# EasyEDA Pro project ESP32核心板带屏幕陀螺仪can接口.epro

# Schematic Schematic1
Create Date: 2023-09-02; Page Name: P1; Project Name: 自制ESP32PICO; Schematic Name: Schematic1; Update Date: 2023-09-13; Company: 嘉立创EDA; Page Size: A4; Version: V1.0
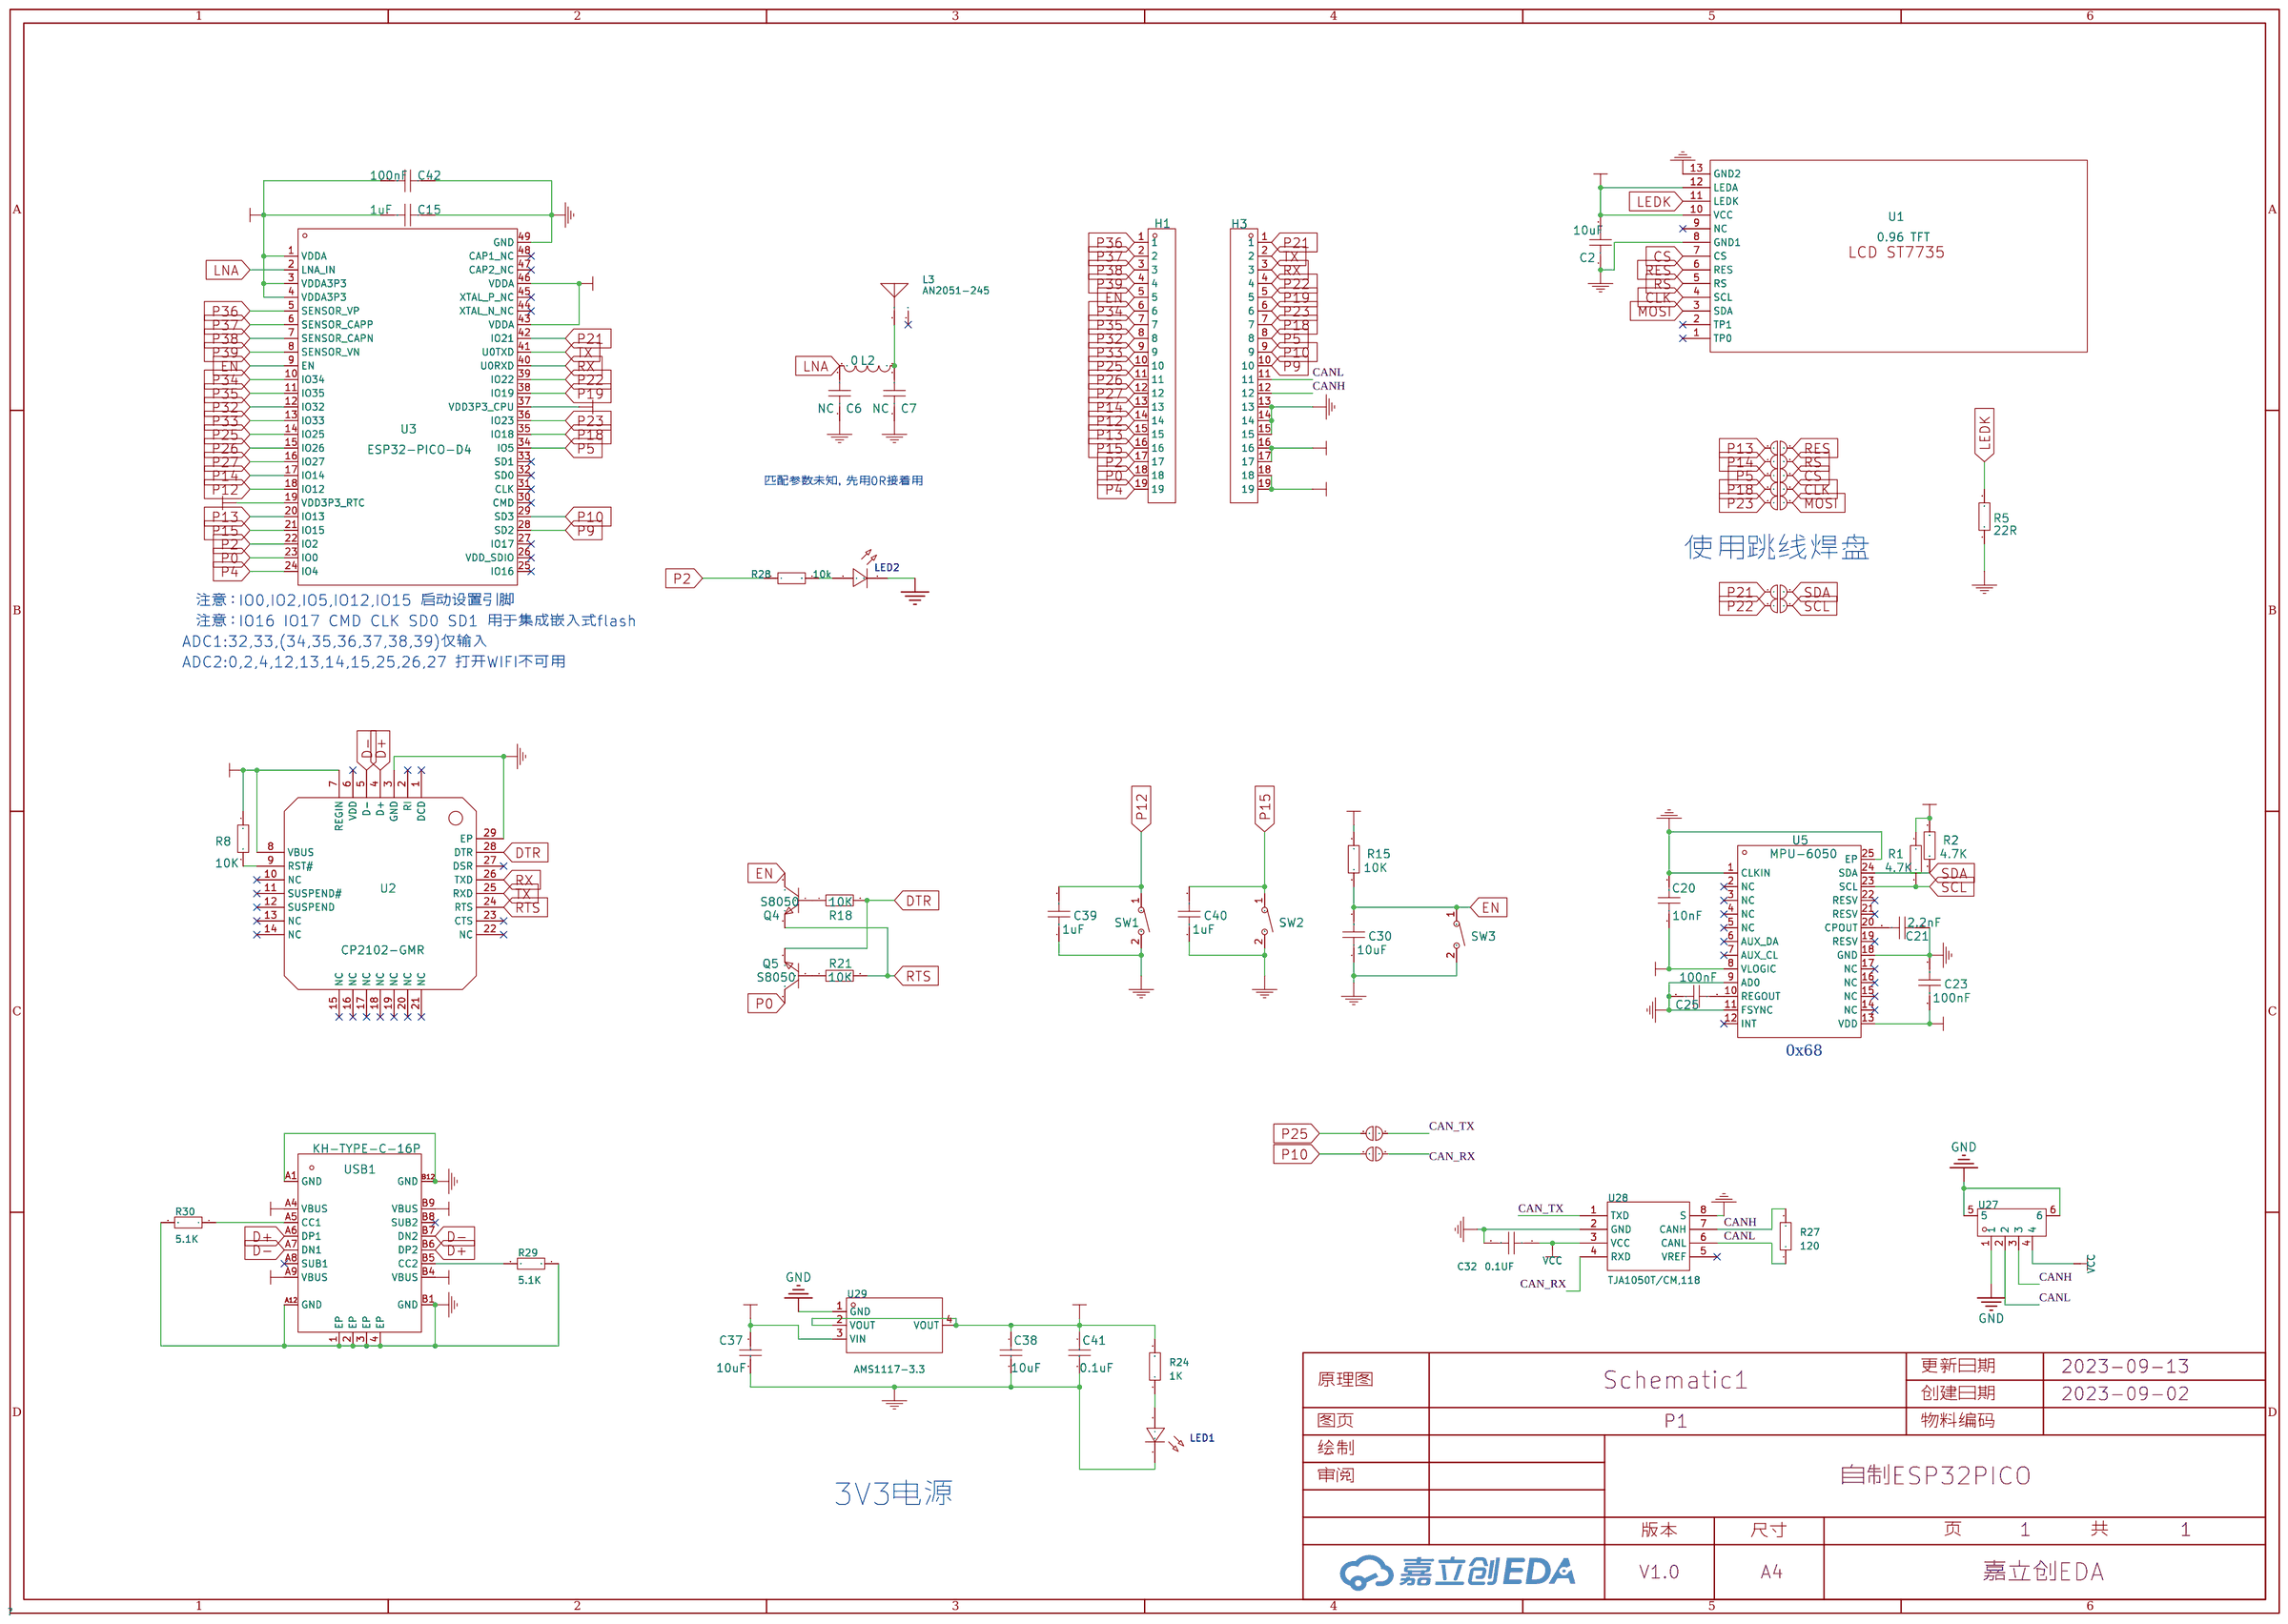
[diagram p0: schematic sheet]

## Parts
C2  10uF  [C0603]
C6  NC  [C0402]
C7  NC  [C0402]
C15  1uF  [C0603]
C20  10nF  [C0603]
C21  2.2nF  [C0603]
C23  100nF  [C0603]
C25  100nF  [C0603]
C30  10uF  [C0603]
C32  0.1UF  [c0603]
C37  10uF  [C0603]
C38  10uF  [C0603]
C39  1uF  [C0603]
C40  1uF  [C0603]
C41  0.1uF  [C0603]
C42  100nF  [C0603]
H1  X6511WV-19H-C30D60  [HDR-TH_19P-P2.54-V-M]
H3  X6511WV-19H-C30D60  [HDR-TH_19P-P2.54-V-M]
J2  跳线焊盘  [0402L焊盘]
J3  跳线焊盘  [0402L焊盘]
J4  跳线焊盘  [0402L焊盘]
J5  跳线焊盘  [0402L焊盘]
J6  跳线焊盘  [0402L焊盘]
J7  跳线焊盘  [0402L焊盘]
J8  跳线焊盘  [0402L焊盘]
J9  跳线焊盘  [0402L焊盘]
J10  跳线焊盘  [0402L焊盘]
L2  0  [L0402]
L3  AN2051-245  [ANT2051]
LED1  -  [LED_0603]
LED2  -  [LED_0603]
Q4  S8050  [SOT-23-3_L2.9-W1.3-P1.90-LS2.4-BR]
Q5  S8050  [SOT-23-3_L2.9-W1.3-P1.90-LS2.4-BR]
R1  4.7K  [R0603]
R2  4.7K  [R0603]
R5  22R  [R0603]
R8  10K  [R0603]
R15  10K  [R0603]
R18  10K  [R0603]
R21  10K  [R0603]
R24  1K  [r0603]
R27  120  [r0603]
R28  10k  [r0603]
R29  5.1K  [r0603]
R30  5.1K  [r0603]
SW1  TS342A2P-WZ  [SW-SMD_L4.0-W2.9-LS5.0]
SW2  TS342A2P-WZ  [SW-SMD_L4.0-W2.9-LS5.0]
SW3  TS342A2P-WZ  [SW-SMD_L4.0-W2.9-LS5.0]
U1  0.96 TFT  [0.96 LCD]
U2  CP2102-GMR  [QFN-28_L5.0-W5.0-P0.50-BL-EP]
U3  ESP32-PICO-D4  [QFN-48_L7.0-W7.0-P0.50-BL-EP5.1]
U5  MPU-6050  [QFN-24_L4.0-W4.0-P0.50-BL-EP2.6]
U27  SH1.0-4P  [CONN-SMD_4P-P1.00_SH1.0-4P]
U28  TJA1050T/CM,118  [SOIC-8_L5.0-W4.0-P1.27-LS6.0-BL]
U29  AMS1117-3.3  [SOT-223-3_L6.5-W3.4-P2.30-LS7.0-BR]
USB1  KH-TYPE-C-16P  [USB-C-SMD_KH-TYPE-C-16P]

## Library data of the parts
C2 = 10uF: Supplier: LCSC; Manufacturer: SAMSUNG; Manufacturer Part: CL10B104KC8NNNC; Supplier Part: C18800; JLCPCB Part Class: Extend
C6 C7 = NC: Supplier: LCSC; Manufacturer: MuRata; Manufacturer Part: GJM1555C1H1R2CB01D; Supplier Part: C85877
C15 C42 = 100nF: Supplier: LCSC; Manufacturer: SAMSUNG; Manufacturer Part: CL10B104KC8NNNC; Supplier Part: C15725; JLCPCB Part Class: Extend
C20 = 10nF: Supplier: LCSC; Manufacturer: SAMSUNG; Manufacturer Part: CL10B104KC8NNNC; Supplier Part: C15725; JLCPCB Part Class: Extended Part
C21 = 2.2nF: Supplier: LCSC; Manufacturer: SAMSUNG; Manufacturer Part: CL10B104KC8NNNC; Supplier Part: C15725; JLCPCB Part Class: Extended Part
C23 C25 = 100nF: Supplier: LCSC; Manufacturer: SAMSUNG; Manufacturer Part: CL10B104KC8NNNC; Supplier Part: C15725; JLCPCB Part Class: Extended Part
C30 C39 C40 = 1uF: Supplier: LCSC; Manufacturer: SAMSUNG; Manufacturer Part: CL10B104KC8NNNC; Supplier Part: C15725; JLCPCB Part Class: Extended Part
C32 = CAP_0805: Supplier Footprint: 0805
C37 C38 C41 = 10uF: Supplier: LCSC; Manufacturer: FH; Manufacturer Part: 0603F105M160NT; Supplier Part: C1689
H1 H3 = X6511WV-19H-C30D60: Supplier: LCSC; Supplier Part: C725951; Manufacturer: XKB Connectivity; JLCPCB Part Class: Extended Part
J2-J10 = 跳线焊盘
L2 = 0: Supplier: LCSC; Manufacturer: MuRata; Manufacturer Part: LQG15HS2N4S02D; Supplier Part: C97997
L3 = AN2051-245: 小体积，高增益，WIFI，蓝牙，zigBee 2.4G天线; Supplier Part: C99727; Manufacturer: rainsun(霖昱微); Supplier Footprint: 2x5.1mm; JLCPCB Part Class: 扩展库; Datasheet: https://atta.szlcsc.com/upload/public/pdf/source/20170329/1490752053541.pdf; Supplier: LCSC
LED1 LED2 = LED_0603-G: Supplier Footprint: 0603
Q4 Q5 = S8050: Supplier: LCSC; Supplier Part: C2688231; Manufacturer: WPMtek(维攀微)
R1 R2 = 4.7K: Supplier: LCSC; Manufacturer: RALEC; Manufacturer Part: RTT031002FTP; Supplier Part: C103199; JLCPCB Part Class: Extended Part
R5 = 22R: Supplier: LCSC; Manufacturer: UniOhm; Manufacturer Part: 0603WAJ0000T5E; Supplier Part: C15402; JLCPCB Part Class: Extended Part
R8 R18 R21 = 10K: Supplier: LCSC; Manufacturer: UniOhm; Manufacturer Part: 0603WAJ0000T5E; Supplier Part: C15402; JLCPCB Part Class: Extended Part
R15 = 10K: Supplier: LCSC; Manufacturer: RALEC; Manufacturer Part: RTT031002FTP; Supplier Part: C103199; JLCPCB Part Class: Extended Part
R24 R27-R30 = Res_0805: Supplier Footprint: 0805
SW1-SW3 = TS342A2P-WZ: Supplier: LCSC; Supplier Part: C557591; Manufacturer: SHOU HAN; JLCPCB Part Class: Extended Part
U1 = 0.96 TFT
U2 = CP2102-GMR: Supplier: LCSC; Manufacturer: SILICON LABS; Supplier Part: C6568; JLCPCB Part Class: Basic Part
U3 = ESP32-PICO-D4: Supplier: LCSC; Supplier Part: C193707; Manufacturer: Espressif Systems; JLCPCB Part Class: Extended Part
U5 = MPU-6050: Supplier: LCSC; Manufacturer: InvenSense; image: //image.lceda.cn/szlcsc/C24112.jpg; Supplier Part: C24112; JLCPCB Part Class: Basic Part
U27 = SH1.0-4P: Supplier Part: C9900023784; Supplier Footprint: CONN-SMD-4P; JLCPCB Part Class: 扩展库; Supplier: LCSC
U28 = TJA1050T/CM,118: 类型:收发器;; LCSC Part Name: 4.75V~5.25V; Supplier Part: C6952; Manufacturer: NXP(恩智浦); Supplier Footprint: SOIC-8; Datasheet: https://atta.szlcsc.com/upload/public/pdf/source/20140411/1457707042917.pdf; Supplier: LCSC; Type: 收发器; Supply Voltage: 4.75V~5.25V; Supply Current: 50mA
U29 = AMS1117-3.3_C6186: 输出类型:固定;输出极性:正;最大输入电压:-;输出电压:3.3V;输出电流:1A;电源纹波抑制比(PSRR):72dB@(120Hz);; LCSC Part Name: 输出3.3V 1A; Supplier Part: C6186; Manufacturer: AMS; Supplier Footprint: SOT-223; JLCPCB Part Class: 基础库; Datasheet: https://atta.szlcsc.com/upload/public/pdf/source/20180727/C6186_7A095716F0823C02F1997A905E26C086.pdf; Supplier: LCSC; Output Type: 固定; Output Polarity: 正; Number of Outputs: 1; Output Voltage: 3.3V; Dropout Voltage: 1.3V@(800mA); Output Current: 1A; Power Supply Rejection Ratio (PSRR): 72dB@(120Hz)
USB1 = KH-TYPE-C-16P: Supplier: LCSC; Supplier Part: C709357; Manufacturer: Shenzhen Kinghelm Elec

## Nets
3V3: C2.2 C15.2 C20.1 C23.1 C38.1 C41.1 C42.2 H3.16 H3.17 R1.1 R2.1 R15.1 R24.2 U1.10(VCC) U1.12(LEDA) U3.1(VDDA) U3.3(VDDA3P3) U3.4(VDDA3P3) U3.19(VDD3P3_RTC) U3.37(VDD3P3_CPU) U3.43(VDDA) U3.46(VDDA) U5.8(VLOGIC) U5.13(VDD) U29.2(VOUT) U29.4(VOUT)
GND: C2.1 C6.1 C7.1 C15.1 C20.2 C21.1 C23.2 C25.2 C30.1 C32.2 C37.2 C38.2 C39.1 C40.1 C41.2 C42.1 H3.13 H3.14 H3.15 LED1.1(C) LED2.1(C) R5.1 R29.1 R30.2 SW1.2 SW2.2 SW3.2 U1.8(GND1) U1.13(GND2) U2.3(GND) U2.29(EP) U3.49(GND) U5.1(CLKIN) U5.9(AD0) U5.11(FSYNC) U5.18(GND) U5.25(EP) U27.1 U27.5 U27.6 U28.2(GND) U28.8(S) U29.1(GND) USB1.1(EP) USB1.2(EP) USB1.3(EP) USB1.4(EP) USB1.A1(GND) USB1.A12(GND) USB1.B1(GND) USB1.B12(GND)
VCC: C32.1 C37.1 H3.18 H3.19 R8.1 U2.7(REGIN) U2.8(VBUS) U27.4 U28.3(VCC) U29.3(VIN) USB1.A4(VBUS) USB1.A9(VBUS) USB1.B4(VBUS) USB1.B9(VBUS)
CAN_RX: J10.2 U28.4(RXD)
CAN_TX: J9.2 U28.1(TXD)
CANH: H3.12 R27.2 U27.3 U28.7(CANH)
CANL: H3.11 R27.1 U27.2 U28.6(CANL)
CLK: J5.2 U1.4(SCL)
CS: J2.2 U1.7(CS)
D+: U2.4(D+) USB1.A6(DP1) USB1.B6(DP2)
D-: U2.5(D-) USB1.A7(DN1) USB1.B7(DN2)
DTR: Q5.2(E) R18.2 U2.28(DTR)
EN: C30.2 H1.5 Q4.3(C) R15.2 SW3.1 U3.9(EN)
LEDK: R5.2 U1.11(LEDK)
LNA: C6.2 L2.2 U3.2(LNA_IN)
MOSI: J6.2 U1.3(SDA)
P0: H1.18 Q5.3(C) U3.23(IO0)
P2: H1.17 R28.1 U3.22(IO2)
P4: H1.19 U3.24(IO4)
P5: H3.8 J2.1 U3.34(IO5)
P9: H3.10 U3.28(SD2)
P10: H3.9 J10.1 U3.29(SD3)
P12: C39.2 H1.14 SW1.1 U3.18(IO12)
P13: H1.15 J3.1 U3.20(IO13)
P14: H1.13 J4.1 U3.17(IO14)
P15: C40.2 H1.16 SW2.1 U3.21(IO15)
P18: H3.7 J5.1 U3.35(IO18)
P19: H3.5 U3.38(IO19)
P21: H3.1 J8.1 U3.42(IO21)
P22: H3.4 J7.1 U3.39(IO22)
P23: H3.6 J6.1 U3.36(IO23)
P25: H1.10 J9.1 U3.14(IO25)
P26: H1.11 U3.15(IO26)
P27: H1.12 U3.16(IO27)
P32: H1.8 U3.12(IO32)
P33: H1.9 U3.13(IO33)
P34: H1.6 U3.10(IO34)
P35: H1.7 U3.11(IO35)
P36: H1.1 U3.5(SENSOR_VP)
P37: H1.2 U3.6(SENSOR_CAPP)
P38: H1.3 U3.7(SENSOR_CAPN)
P39: H1.4 U3.8(SENSOR_VN)
RES: J3.2 U1.6(RES)
RS: J4.2 U1.5(RS)
RTS: Q4.2(E) R21.2 U2.24(RTS)
RX: H3.3 U2.26(TXD) U3.40(U0RXD)
SCL: J7.2 R1.2 U5.23(SCL)
SDA: J8.2 R2.2 U5.24(SDA)
TX: H3.2 U2.25(RXD) U3.41(U0TXD)
$1N3010: R8.2 U2.9(RST#)
$1N3024: Q5.1(B) R21.1
$1N3025: Q4.1(B) R18.1
$1N3047: C25.1 U5.10(REGOUT)
$1N3048: C21.2 U5.20(CPOUT)
$1N3131: C7.2 L2.1 L3.1(ANT)
$1N4781: R29.2 USB1.B5(CC2)
$1N4796: R30.1 USB1.A5(CC1)
Net-(LED1-2): LED1.2(A) R24.1
Net-(LED2-2): LED2.2(A) R28.2

Not connected (* = marked no-connect by the designer): L3 2*; U1 1(TP0)* 2(TP1)* 9(NC)*; U2 1(DCD)* 2(RI)* 6(VDD)* 10(NC)* 11(SUSPEND#)* 12(SUSPEND)* 13(NC)* 14(NC)* 15(NC)* 16(NC)* 17(NC)* 18(NC)* 19(NC)* 20(NC)* 21(NC)* 22(NC)* 23(CTS)* 27(DSR)*; U3 25(IO16)* 26(VDD_SDIO)* 27(IO17)* 30(CMD)* 31(CLK)* 32(SD0)* 33(SD1)* 44(XTAL_N_NC)* 45(XTAL_P_NC)* 47(CAP2_NC)* 48(CAP1_NC)*; U5 2(NC)* 3(NC)* 4(NC)* 5(NC)* 6(AUX_DA)* 7(AUX_CL)* 12(INT)* 14(NC)* 15(NC)* 16(NC)* 17(NC)* 19(RESV)* 21(RESV)* 22(RESV)*; U28 5(VREF)*; USB1 A8(SUB1)* B8(SUB2)*

## Notes on the sheet
- 匹配参数未知，先用0R接着用
- 使用跳线焊盘
- 注意：IO0,IO2,IO5,IO12,IO15 启动设置引脚
- 注意：IO16 IO17 CMD CLK SD0 SD1 用于集成嵌入式flash
- ADC1:32,33,(34,35,36,37,38,39)仅输入
- ADC2:0,2,4,12,13,14,15,25,26,27 打开WIFI不可用
- 0x68
- 3V3电源

# Board PCB1
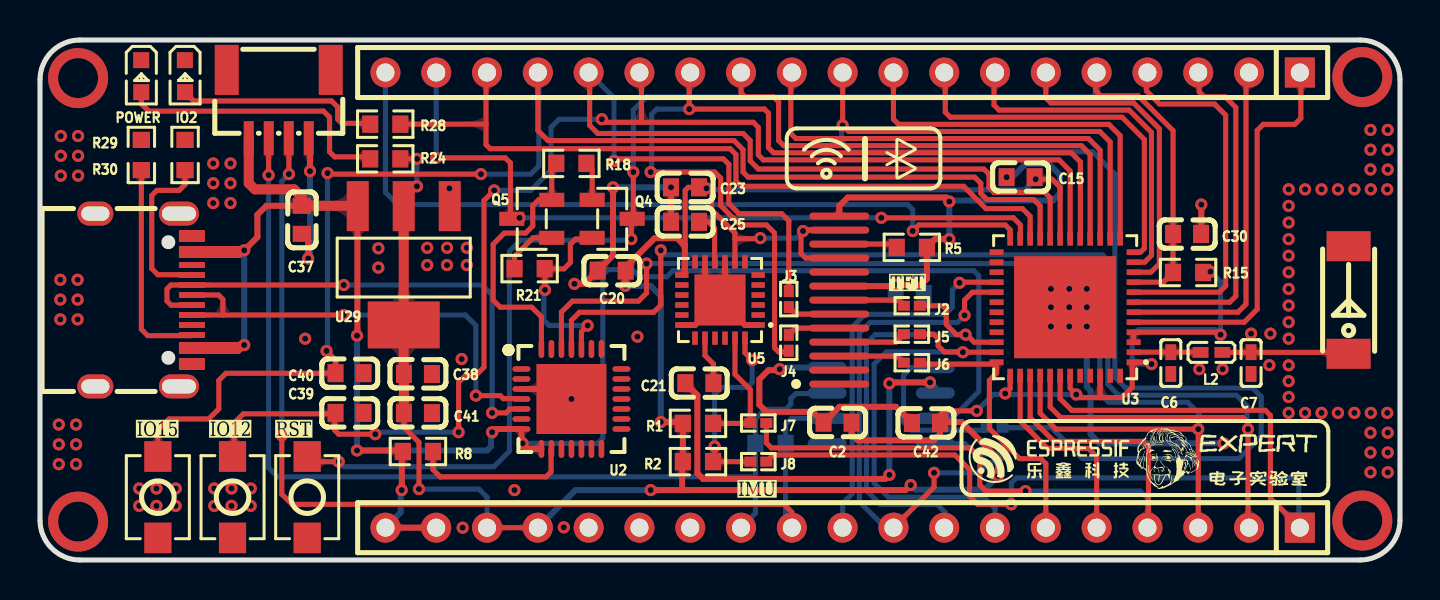
[diagram p1: board, top side]
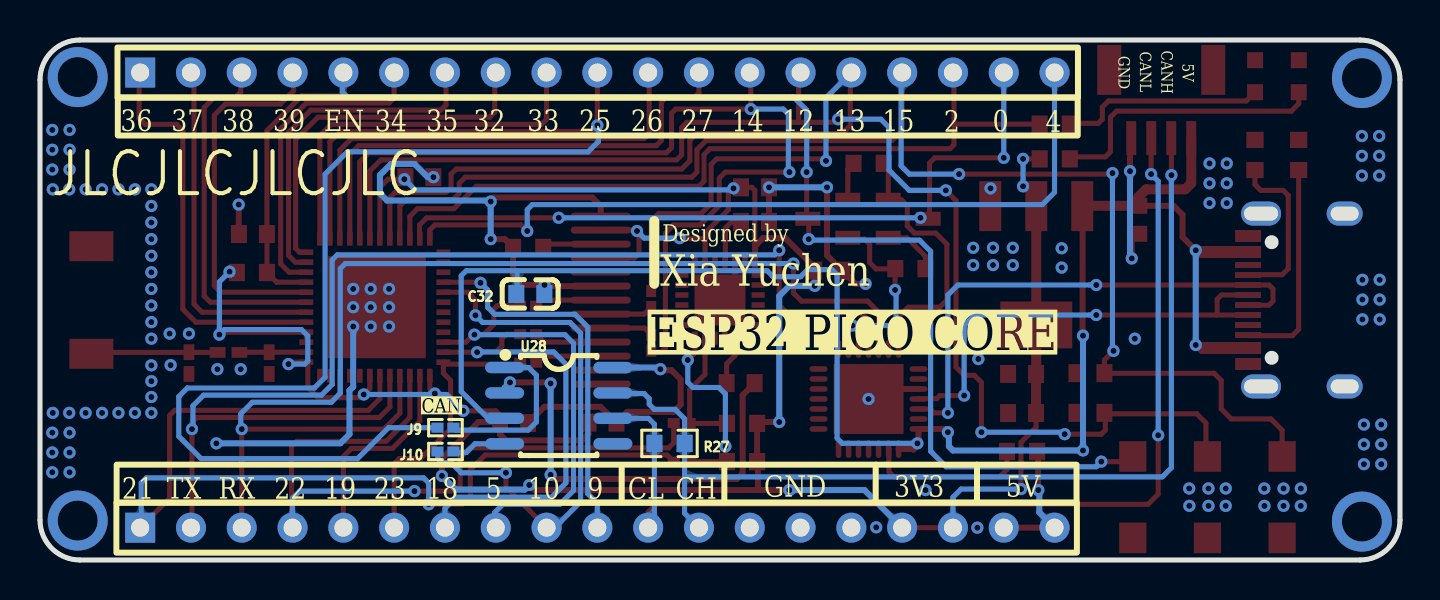
[diagram p2: board, bottom side, seen from below]

Outline 68 x 26 mm; copper layers: Top Layer, Bottom Layer. Coordinates in mm from the lower left corner of the outline.
Outline path: 0,24 0,2 arc(0.59,0.59) 2,0 66,0 arc(67.41,0.59) 68,2 68,24 arc(67.41,25.41) 66,26 2,26 arc(0.59,25.41) 0,24
Stack: Top Layer 0.035mm / Dielectric1 1.51mm FR4 er 4.5 / Bottom Layer 0.035mm

## Design rules (mm)
template: 自定义配置
spacing copperThickness1oz (default): track to track 0.102, other pairs 0 to 0.3
spacing copperThickness2oz: track to track 0.203, other pairs 0.152 to 0.3
track width copperThickness1oz (default): min 0.127, default 0.254, max 2.54
track width copperThickness2oz: min 0.203, default 0.254, max 2.54
differential pair differentialPair (default): width min 0.127, default 0.254, max 2.54; gap min 0.152, default 0.152
via viaSize (default): diameter min 0.5, default 0.61, max 10; hole min 0.3, default 0.305, max 6.3

## Placement (name value [footprint] x y rotation side)
C2  10uF  [C0603]  39.88 6.87 0 top
C6  NC  [C0402]  56.54 9.85 90 top
C7  NC  [C0402]  60.55 9.85 90 top
C15  1uF  [C0603]  49.03 19.14 0 top
C20  10nF  [C0603]  28.58 14.47 180 top
C21  2.2nF  [C0603]  32.97 8.84 0 top
C23  100nF  [C0603]  32.25 18.63 180 top
C25  100nF  [C0603]  32.25 16.91 180 top
C30  10uF  [C0603]  57.35 16.3 180 top
C32  0.1UF  [c0603]  43.49 13.3 180 bottom
C37  10uF  [C0603]  13.09 17.01 270 top
C38  10uF  [C0603]  18.9 9.3 0 top
C39  1uF  [C0603]  15.48 7.36 180 top
C40  1uF  [C0603]  15.48 9.34 180 top
C41  0.1uF  [C0603]  18.9 7.35 0 top
C42  100nF  [C0603]  44.3 6.85 0 top
H1  X6511WV-19H-C30D60  [HDR-TH_19P-P2.54-V-M]  40.13 24.37 180 top
H3  X6511WV-19H-C30D60  [HDR-TH_19P-P2.54-V-M]  40.13 1.62 180 top
IO2  -  [LED_0603]  7.25 24.14 270 top
J2  跳线焊盘  [0402L焊盘]  43.59 12.71 180 top
J3  跳线焊盘  [0402L焊盘]  37.44 13.05 270 top
J4  跳线焊盘  [0402L焊盘]  37.44 10.86 90 top
J5  跳线焊盘  [0402L焊盘]  43.59 11.29 180 top
J6  跳线焊盘  [0402L焊盘]  43.59 9.86 180 top
J7  跳线焊盘  [0402L焊盘]  35.92 6.85 180 top
J8  跳线焊盘  [0402L焊盘]  35.92 4.92 180 top
J9  跳线焊盘  [0402L焊盘]  47.73 6.62 180 bottom
J10  跳线焊盘  [0402L焊盘]  47.73 5.43 180 bottom
L2  0  [L0402]  58.57 10.38 180 top
L3  AN2051-245  [ANT2051]  65.43 13 90 top
POWER  -  [LED_0603]  5.07 24.14 270 top
Q4  S8050  [SOT-23-3_L2.9-W1.3-P1.90-LS2.4-BR]  28.61 17.06 180 top
Q5  S8050  [SOT-23-3_L2.9-W1.3-P1.90-LS2.4-BR]  24.59 17.06 0 top
R1  4.7K  [R0603]  32.9 6.83 0 top
R2  4.7K  [R0603]  32.9 4.92 0 top
R5  22R  [R0603]  43.59 15.63 180 top
R8  10K  [R0603]  18.9 5.43 0 top
R15  10K  [R0603]  57.4 14.38 180 top
R18  10K  [R0603]  26.57 19.83 180 top
R21  10K  [R0603]  24.48 14.57 0 top
R24  1K  [r0603]  17.26 20.06 0 top
R27  120  [r0603]  36.53 5.83 180 bottom
R28  10k  [r0603]  17.26 21.79 180 top
R29  5.1K  [r0603]  5.07 20.25 270 top
R30  5.1K  [r0603]  7.25 20.25 90 top
SW1  TS342A2P-WZ  [SW-SMD_L4.0-W2.9-LS5.0]  9.63 3.14 270 top
SW2  TS342A2P-WZ  [SW-SMD_L4.0-W2.9-LS5.0]  5.89 3.14 270 top
SW3  TS342A2P-WZ  [SW-SMD_L4.0-W2.9-LS5.0]  13.36 3.14 270 top
U1  0.96 TFT  [0.96 LCD]  39.96 13 0 top
U2  CP2102-GMR  [QFN-28_L5.0-W5.0-P0.50-BL-EP]  26.57 8.05 270 top
U3  ESP32-PICO-D4  [QFN-48_L7.0-W7.0-P0.50-BL-EP5.1]  51.26 12.64 90 top
U5  MPU-6050  [QFN-24_L4.0-W4.0-P0.50-BL-EP2.6]  34 13 90 top
U27  SH1.0-4P  [CONN-SMD_4P-P1.00_SH1.0-4P]  11.94 22.8 180 top
U28  TJA1050T/CM,118  [SOIC-8_L5.0-W4.0-P1.27-LS6.0-BL]  42.06 7.72 270 bottom
U29  AMS1117-3.3  [SOT-223-3_L6.5-W3.4-P2.30-LS7.0-BR]  18.19 14.72 90 top
USB1  KH-TYPE-C-16P  [USB-C-SMD_KH-TYPE-C-16P]  5.18 13 270 top

## Footprints (pads in the part's own frame, mm; a bottom-side part is the same pattern mirrored in y, then rotated)
0.96 LCD
  oval 3x0.35 smd: 1(0,-4.2) 2(0,-3.5) 3(0,-2.8) 4(0,-2.1) 5(0,-1.4) 6(0,-0.7) 7(0,0) 8(0,0.7) 9(0,1.4) 10(0,2.1) 11(0,2.8) 12(0,3.5) 13(0,4.2)
0402L焊盘
  rect 0.6x0.5 smd: 1(-0.4,0) 2(0.4,0)
ANT2051
  rect 1.5x2.2 smd: 1(-2.69,0) 2(2.69,0)
C0402
  rect 0.79x0.54 smd: 1(-0.545,0) 2(0.545,0)
C0603
  rect 0.8x0.9 smd: 1(-0.7,0) 2(0.7,0)
c0603
  rect 0.8x0.9 smd: 1(-0.7,0) 2(0.7,0)
CONN-SMD_4P-P1.00_SH1.0-4P
  rect 0.5x1.7 smd: 1(-1.5,1.705) 2(-0.5,1.705) 3(0.5,1.705) 4(1.5,1.705)
  rect 1.2x2.5 smd: 5(-2.6,-1.705) 6(2.6,-1.705)
HDR-TH_19P-P2.54-V-M
  rect 1.5x1.5 hole 0.9: 1(-22.86,0)
  round 1.5 hole 0.9: 2(-20.32,0) 3(-17.78,0) 4(-15.24,0) 5(-12.7,0) 6(-10.16,0) 7(-7.62,0) 8(-5.08,0) 9(-2.54,0) 10(0,0) 11(2.54,0) 12(5.08,0) 13(7.62,0) 14(10.16,0) 15(12.7,0) 16(15.24,0) 17(17.78,0) 18(20.32,0) 19(22.86,0)
L0402
  rect 0.79x0.54 smd: 1(-0.545,0) 2(0.545,0)
LED_0603
  rect 0.8x0.8 smd: 1(-0.851,-0.01) 2(0.75,-0.005)
QFN-24_L4.0-W4.0-P0.50-BL-EP2.6
  rect 0.28x0.665 smd: 1(-1.25,-1.907) 2(-0.75,-1.907) 3(-0.25,-1.907) 4(0.25,-1.907) 5(0.75,-1.907) 6(1.25,-1.907) 13(1.25,1.907) 14(0.75,1.907) 15(0.25,1.907) 16(-0.25,1.907) 17(-0.75,1.907) 18(-1.25,1.907)
  rect 0.665x0.28 smd: 7(1.907,-1.25) 8(1.907,-0.75) 9(1.907,-0.25) 10(1.907,0.25) 11(1.907,0.75) 12(1.907,1.25) 19(-1.907,1.25) 20(-1.907,0.75) 21(-1.907,0.25) 22(-1.907,-0.25) 23(-1.907,-0.75) 24(-1.907,-1.25)
  rect 2.55x2.55 smd: 25(0,0)
QFN-28_L5.0-W5.0-P0.50-BL-EP
  oval 0.28x0.9 smd: 1(-1.501,-2.5) 2(-1.001,-2.5) 3(-0.5,-2.5) 4(0,-2.5) 5(0.5,-2.5) 6(1,-2.5) 7(1.501,-2.5) 15(1.501,2.5) 16(1,2.5) 17(0.5,2.5) 18(0,2.5) 19(-0.5,2.5) 20(-1.001,2.5) 21(-1.501,2.5)
  oval 0.9x0.28 smd: 8(2.5,-1.502) 9(2.5,-1.001) 10(2.5,-0.5) 11(2.5,-0.001) 12(2.5,0.5) 13(2.5,1) 14(2.5,1.501) 22(-2.5,1.501) 23(-2.5,1) 24(-2.5,0.5) 25(-2.5,-0.001) 26(-2.5,-0.5) 27(-2.5,-1.001) 28(-2.5,-1.502)
  rect 3.5x3.5 smd: 29(0,0)
QFN-48_L7.0-W7.0-P0.50-BL-EP5.1
  rect 0.28x0.7 smd: 1(-2.75,-3.428) 2(-2.25,-3.428) 3(-1.75,-3.428) 4(-1.25,-3.428) 5(-0.75,-3.428) 6(-0.25,-3.428) 7(0.25,-3.428) 8(0.75,-3.428) 9(1.25,-3.428) 10(1.75,-3.428) 11(2.25,-3.428) 12(2.75,-3.428) 25(2.75,3.428) 26(2.25,3.428) 27(1.75,3.428) 28(1.25,3.428) 29(0.75,3.428) 30(0.25,3.428) 31(-0.25,3.428) 32(-0.75,3.428) 33(-1.25,3.428) 34(-1.75,3.428) 35(-2.25,3.428) 36(-2.75,3.428)
  rect 0.7x0.28 smd: 13(3.428,-2.75) 14(3.428,-2.25) 15(3.428,-1.75) 16(3.428,-1.25) 17(3.428,-0.75) 18(3.428,-0.25) 19(3.428,0.25) 20(3.428,0.75) 21(3.428,1.25) 22(3.428,1.75) 23(3.428,2.25) 24(3.428,2.75) 37(-3.428,2.75) 38(-3.428,2.25) 39(-3.428,1.75) 40(-3.428,1.25) 41(-3.428,0.75) 42(-3.428,0.25) 43(-3.428,-0.25) 44(-3.428,-0.75) 45(-3.428,-1.25) 46(-3.428,-1.75) 47(-3.428,-2.25) 48(-3.428,-2.75)
  rect 5.1x5.1 smd: 49(0,0)
r0603
  rect 0.806x0.864 smd: 1(-0.753,0) 2(0.753,0)
R0603
  rect 0.806x0.864 smd: 1(-0.753,0) 2(0.753,0)
SOIC-8_L5.0-W4.0-P1.27-LS6.0-BL
  oval 0.569x1.95 smd: 1(-1.905,-2.705) 2(-0.635,-2.705) 3(0.635,-2.705) 4(1.905,-2.705) 5(1.905,2.705) 6(0.635,2.705) 7(-0.635,2.705) 8(-1.905,2.705)
SOT-23-3_L2.9-W1.3-P1.90-LS2.4-BR
  rect 1.25x0.7 smd: 1(1,-0.95) 2(1,0.95) 3(-1,0)
SOT-223-3_L6.5-W3.4-P2.30-LS7.0-BR
  rect 2.5x1.1 smd: 1(2.97,-2.3) 2(2.97,0) 3(2.97,2.3)
  rect 2.34x3.6 smd: 4(-2.97,0)
SW-SMD_L4.0-W2.9-LS5.0
  rect 1.53x1.36 smd: 1(-2.035,0) 2(2.035,0)
USB-C-SMD_KH-TYPE-C-16P
  oval 1.2x2 hole 0.7x1.7: 1(-4.32,1.765) 2(4.32,1.765)
  oval 1.2x1.8 hole 0.7x1.4: 3(-4.32,-2.415) 4(4.32,-2.415)
  rect 0.3x1.3 smd: A1(-3.35,2.416) A4(-2.55,2.416) A5(-1.25,2.416) A6(-0.25,2.416) A7(0.25,2.416) A8(1.25,2.415) A9(2.55,2.415) A12(3.35,2.416) B1(3.05,2.416) B4(2.25,2.415) B5(1.75,2.416) B6(0.75,2.416) B7(-0.75,2.416) B8(-1.75,2.415) B9(-2.25,2.416) B12(-3.05,2.416)

## Nets
As in the schematic, except:
GND: C2.1 C6.1 C7.1 C15.1 C20.2 C21.1 C23.2 C25.2 C30.1 C32.2 C37.2 C38.2 C39.1 C40.1 C41.2 C42.1 H3.13 H3.14 H3.15 IO2.1 POWER.1 R5.1 R29.1 R30.2 SW1.2 SW2.2 SW3.2 U1.8 U1.13 U2.3 U2.29 U3.49 U5.1 U5.9 U5.11 U5.18 U5.25 U27.1 U27.5 U27.6 U28.2 U28.8 U29.1 USB1.1 USB1.2 USB1.3 USB1.4 USB1.A1 USB1.A12 USB1.B1 USB1.B12
$1N4638: POWER.2 R24.1
$1N4725: IO2.2 R28.2

Pads without a net: L3 2; U1 1 2 9; U2 1 2 6 10 11 12 13 14 15 16 17 18 19 20 21 22 23 27; U3 25 26 27 30 31 32 33 44 45 47 48; U5 2 3 4 5 6 7 12 14 15 16 17 19 21 22; U28 5; USB1 A8 B8

## Via types
v1: diameter 3, hole 2, Top Layer to Bottom Layer, 4 vias
v2: diameter 0.61, hole 0.305, Top Layer to Bottom Layer, 184 vias

## Routing (per net, layer and track width the routed paths; a pad name or vN(x,y) marks a point on that pad's centre or on a via; arc(x,y) is an arc through that point)
3V3: length 150.6
  Top Layer w0.254: H3.17 H3.16 ; U29.2 18.19,18.02 v2(18.85,18.69) ; R15.1 58.2,14.42 v2(58.52,14.42) ; 53.01,8.12 53.01,8.12 U3.46 ; 53.01,8.12 54.1,8.12 54.61,8.63 54.61,9.81 U3.1 55.48,9.89 v2(55.57,9.8) ; 53.01,8.12 51.97,8.12 51.51,8.58 U3.43 ; 38.25,16.5 U1.12 39.96,16.5 38.25,16.5 38.25,16.5 ; 38.25,16.5 38.05,16.3 38.05,15.33 38.29,15.1 U1.10 ; 38.25,16.5 38.2,16.5 v2(38.15,16.45) ; v2(18.95,3.55) 18.95,5.88 18.2,6.63 C41.1 ; 34.75,16.07 34.75,14.91 U5.8 ; 34.75,16.07 35.99,16.07 v2(36.02,16.09) ; 34.75,16.07 34.75,16.35 33.58,17.51 33.58,18.38 33.33,18.63 C23.1 ; v2(49.78,19.04) 50.6,19.04 51.01,18.63 U3.19 ; v2(48.26,8.32) 48.51,8.57 U3.37 ; 32.26,15.82 32.26,18.48 32.41,18.63 C23.1 ; v2(46.84,7.46) 45.21,7.46 45,7.24 C42.2 ; C23.1 33,18.58 v2(33.32,18.58) ; U3.3 U3.4 58.91,11.39 v2(59.03,11.27) ; 18.01,20.06 v2(18.85,20.06) ; 32.14,15.75 32.21,15.82
  Top Layer w0.3: 32.25,14.25 32.25,15.75 32.22,15.78 ; C2.2 40.58,6.3 40.89,5.98 44.7,5.98 45,6.28 C42.2 45.05,6.9 46.08,6.9 47.9,5.07 v2(47.9,4.21) ; 32.11,3.5 43.28,3.5 v2(43.54,3.75) ; 32.11,3.5 v2(30.53,3.5) ; 32.11,3.5 32.11,4.88 R2.1 R1.1 32.08,6.9 v2(31.04,6.9) ; C20.1 29.28,13.73 v2(29.26,13.71) ; 32.17,15.78 31.86,16.09 30.73,16.09 29.39,14.75 29.39,14.47
  Top Layer w0.5: U29.2 U29.4 18.19,9.31 C38.1 C41.1
  Bottom Layer w0.254: v2(46.84,7.46) 47.65,8.28 v2(51.81,8.28) ; v2(36.02,16.09) 37.79,16.09 v2(38.15,16.45) ; v2(18.85,20.06) v2(18.85,18.69) ; v2(49.78,19.04) 49.25,18.51 33.4,18.51 v2(33.32,18.58) ; v2(58.52,14.42) 59.03,13.91 v2(59.03,11.27) 58.78,11.52 54.93,11.52 54.61,11.21 54.61,9.94 54.76,9.8 v2(55.57,9.8) ; H3.17 22.35,3.14 21.95,3.55 v2(18.95,3.55)
  Bottom Layer w0.3: v2(47.9,4.21) 47.22,3.52 43.77,3.52 v2(43.54,3.75) ; v2(48.26,8.32) 48.46,8.32 48.5,8.28 ; v2(30.53,3.5) 26.77,3.5 H3.16 ; v2(29.26,13.71) 30.53,13.71 31.04,13.2 v2(31.04,6.9)
GND: length 105.9
  Top Layer w0.3: v2(42.47,8.83) 42.52,8.88 v2(44.5,8.88) ; 31.55,16.91 v2(31.55,18.63) ; v2(26.57,8.05) 26.07,8.55 U2.3 ; v2(13.41,15.08) 13.41,15.98 C37.2 ; U5.9 34.25,13.25 U5.25 ; U5.25 33.25,13.75 U5.11 ; U5.25 32.75,11.75 U5.18 ; U5.25 35.25,11.75 U5.1 ; C21.1 32.87,8.25 32.87,4.34 33.15,4.05 42.27,4.05 v2(42.47,4.26) ; v2(20.47,18.58) 20.47,17.71 U29.1 ; C30.1 58.06,16.31 v2(58.06,17.77) ; v2(13.5,19.44) 13.5,21.03 U27.1 ; v2(45.47,16.04) 44.76,16.04 R5.1 44.35,14.06 44.04,13.76 v2(42.77,13.76) 42.71,13.69 U1.8 ; U1.13 39.96,17.7 40.39,18.13 45.31,18.13 45.47,17.97 v2(45.47,17.92) ; C42.1 42.78,7.66 39.97,7.66 C2.1 38.64,7.41 36.32,7.41 35.97,7.76 35.97,9.03 36.42,9.49 36.93,9.49 v2(36.98,9.54) ; v2(26.72,13.81) 27.22,13.81 C20.2 28.65,15.23 v2(28.65,18.63)
  Bottom Layer w0.3: v2(44.5,8.88) 44.77,8.61 U28.2 ; v2(48.33,19.14) 48.62,19.14 49.28,19.8 50.44,19.8 51,19.24 51,18.33 50.65,17.97 45.52,17.97 v2(45.47,17.92) v2(45.47,16.04) ; 42.78,13.3 42.77,13.31 v2(42.77,13.76) ; U28.8 37.12,9.62 36.98,9.49 v2(36.98,9.54) ; v2(42.47,8.83) v2(42.47,4.26) ; v2(59.18,5.83) 52.98,5.83 52.53,6.29 52.53,8.47 52.34,8.66 v2(52.34,11.67) ; v2(28.65,18.63) v2(31.55,18.63) ; v2(13.41,15.08) 13.5,15.17 v2(13.5,19.44) ; v2(58.06,17.77) 58.17,17.87
  vias: v2(0.94,6.77) v2(0.94,5.78) v2(0.94,4.79) v2(1.04,21.2) v2(1.04,20.21) v2(1.04,19.22) v2(1.02,14.01) v2(1.02,13.02) v2(1.02,12.03) v2(1.8,6.77) v2(1.8,5.78) v2(1.8,4.79) v2(1.91,21.2) v2(1.91,20.21) v2(1.91,19.22) v2(1.88,14.01) v2(1.88,13.02) v2(1.88,12.03) v2(4.96,3.57) v2(4.96,2.71) v2(5.82,3.57) v2(5.82,2.71) v2(6.79,3.57) v2(6.78,2.71) v2(8.66,19.83) v2(8.66,18.84) v2(8.66,17.85) v2(8.71,3.58) v2(8.71,2.71) v2(9.53,19.83) v2(9.53,18.84) v2(9.53,17.85) v2(9.58,3.58) v2(9.58,2.71) v2(10.54,3.58) v2(10.53,2.71) v2(13.26,11.06) v2(16.92,15.59) v2(16.92,14.62) v2(19.36,15.61) v2(19.36,14.75) v2(20.35,15.61) v2(20.35,14.75) v2(21.08,10.05) v2(21.13,1.62) v2(21.34,15.61) v2(21.34,14.75) v2(23.72,3.5) v2(26.19,1.63) v2(29.87,11.17) v2(50.55,13.56) v2(50.55,12.64) v2(50.55,11.67) v2(51.46,13.56) v2(51.46,12.64) v2(51.46,11.67) v2(52.34,13.56) v2(52.34,12.64) v2(57.96,9.54) v2(59.13,9.54) v2(60.55,11.32) v2(61.52,11.32) v2(61.47,9.74) v2(62.43,18.53) v2(62.43,17.7) v2(62.43,16.87) v2(62.43,16.04) v2(62.43,15.21) v2(62.43,14.38) v2(62.43,13.55) v2(62.43,12.72) v2(62.43,11.89) v2(62.43,11.06) v2(62.43,9.73) v2(62.43,8.94) v2(62.43,8.15) v2(62.43,7.36) v2(63.25,18.53) v2(63.25,7.36) v2(64.08,18.53) v2(64.08,7.36) v2(64.9,18.53) v2(64.9,7.36) v2(65.72,18.53) v2(65.72,7.36) v2(66.52,21.5) v2(66.52,20.51) v2(66.52,19.52) v2(66.54,18.53) v2(66.54,7.36) v2(66.52,6.37) v2(66.52,5.38) v2(66.52,4.38) v2(67.39,21.5) v2(67.39,20.51) v2(67.39,19.52) v2(67.36,18.53) v2(67.36,7.36) v2(67.39,6.37) v2(67.39,5.38) v2(67.39,4.38)
VCC: length 102.3
  Top Layer w0.254: v2(24.13,5.83) 24.07,5.78 ; USB1.B4 USB1.A9
  Top Layer w0.3: v2(15.85,5.48) 18.09,5.48 ; 18.09,5.48 R8.1 ; 18.09,5.48 18.09,3.5 v2(18.09,3.5) ; v2(15.85,11.22) 15.87,11.24 15.87,17.71 ; USB1.B4 v2(10.21,10.75) 9.91,10.45 USB1.A9 ; 10.28,15.55 v2(10.21,15.48) 9.98,15.25 USB1.B9 ; 10.28,15.55 USB1.A4 ; 10.28,15.55 10.87,16.14 10.87,17.26 11.32,17.71 C37.1 ; v2(22.61,6.39) 22.76,6.55 U2.7 24.07,5.78 24.33,5.52 24.36,5.55 U2.8 ; H3.19 H3.18
  Top Layer w0.5: U27.4 10.44,18.84 10.74,18.53 12.7,18.53 13.09,18.14 C37.1 15.87,17.71 U29.3
  Bottom Layer w0.254: C32.1 44.15,13.34 44.15,14.47 ; 44.15,14.47 31.65,14.47 31.34,14.16 29.97,14.16 29.62,14.52 28.4,14.52 28.14,14.27 28.14,6.09 27.89,5.83 v2(24.13,5.83) ; 44.15,14.47 46.69,14.47 46.94,14.21 46.94,8.42 45.6,7.08 U28.3
  Bottom Layer w0.3: v2(18.09,3.5) 18.03,3.44 18.03,2.38 H3.19 ; v2(10.21,10.75) v2(10.21,15.48) ; v2(22.61,6.39) 22.56,6.34 22.56,5.68 22.35,5.48 v2(15.85,5.48) v2(15.85,11.22)
(no net):
  vias: v1(1.91,24.09) v1(1.91,1.92) v1(66.12,24.15) v1(66.12,1.97)
CAN_RX: length 2.8
  Bottom Layer w0.254: U28.4 46.25,5.81 46.69,5.38 47.28,5.38 J10.2
CAN_TX: length 8.5
  Bottom Layer w0.254: J9.2 47.2,6.49 43.59,6.49 43.18,6.9 43.18,9.24 43.57,9.62 U28.1
CANH: length 51
  Top Layer w0.254: U27.3 11.43,21.09 v2(11.43,19.24)
  Bottom Layer w0.254: 35.77,4.16 11.89,4.16 11.43,4.61 v2(11.43,19.24) ; 35.77,4.16 R27.2 35.77,7.06 36.25,7.53 37.29,7.53 37.54,7.79 37.54,8.07 37.79,8.32 39.32,8.32 U28.7 ; 35.77,4.16 35.77,2.34 H3.12
CANL: length 52.1
  Top Layer w0.254: U27.2 12.45,21.09 v2(12.45,19.29) ; H3.11 37.59,2.39 37.2,2.78 12.6,2.78 12.09,3.29 v2(12.09,6.24)
  Bottom Layer w0.254: v2(12.09,6.24) 12.09,18.94 v2(12.45,19.29) ; U28.6 37.57,7.08 37.28,6.79 R27.1 37.28,1.93 H3.11
CLK: length 3.4
  Top Layer w0.254: J5.2 42.8,10.89 U1.4
CS: length 3.3
  Top Layer w0.254: U1.7 42.91,13 J2.2
D+: length 22.7
  Top Layer w0.254: USB1.B6 9.17,12.25 ; 9.17,12.25 v2(15.19,12.25) ; 9.17,12.25 9.14,12.28 9.14,13.03 8.93,13.25 USB1.A6 ; v2(21.79,8.22) 23.01,8.22 23.16,8.07 24.05,8.07 U2.4
  Bottom Layer w0.254: v2(15.19,12.25) 21.27,12.25 21.79,11.72 v2(21.79,8.22)
D-: length 25.9
  Top Layer w0.254: v2(22.61,7.36) 23.3,7.36 23.5,7.55 U2.5 ; USB1.A7 7.59,12.74 6.55,12.74 6.35,12.94 6.35,13.55 6.55,13.75 USB1.B7 v2(15.19,13.75)
  Bottom Layer w0.254: v2(22.61,7.36) 22.61,13.25 22.1,13.75 v2(15.19,13.75)
DTR: length 13.7
  Top Layer w0.254: U2.28 25.07,12.16 24.59,12.64 23.01,12.64 22.66,13 22.66,15.79 23.22,16.35 24.28,16.35 24.64,16.7 24.64,17.72 24.93,18.01 Q5.2 ; Q5.2 25.63,18.05 25.76,18.05 ; Q5.2 25.59,19.6 R18.2
EN: length 73
  Top Layer w0.254: SW3.1 13.62,4.92 v2(14.94,4.92) ; v2(29.67,19.4) 29.67,17.12 Q4.3 29.57,17.02 v2(29.57,16.04) ; U3.9 56.16,13.89 R15.2 56.65,16.3 56.65,16.3 56.65,21.47 54.91,23.21 53.03,23.21 52.78,23.46 52.78,24.32 H1.5
  Bottom Layer w0.254: v2(29.57,16.04) 29.51,15.99 24.03,15.99 23.47,15.43 23.47,5.44 22.69,4.66 15.19,4.66 v2(14.94,4.92) ; H1.5 52.88,24.32 52.88,23.41 52.63,23.16 30.33,23.16 29.67,22.5 v2(29.67,19.4)
LEDK: length 2.9
  Top Layer w0.254: R5.2 42.68,15.8 U1.11
LNA: length 3.3
  Top Layer w0.254: 56.54,10.39 58.02,10.39 L2.2 ; 56.54,10.39 U3.2 ; 56.54,10.39 C6.2
MOSI: length 3.4
  Top Layer w0.254: J6.2 42.86,10.19 U1.3
P0: length 37.2
  Top Layer w0.254: v2(19.81,20.11) 23.27,20.11 23.52,19.85 23.52,17.13 Q5.3 23.64,17.11 v2(23.98,17.11) ; v2(42.06,17.11) 48.67,17.11 49.02,16.75 49.02,16.08 U3.23
  Bottom Layer w0.254: v2(42.06,17.11) v2(23.98,17.11) ; H1.18 v2(19.81,20.11)
P2: length 38.5
  Top Layer w0.254: 22.3,21.81 22.3,20.77 22.5,20.56 34.51,20.56 34.8,20.27 34.8,18.94 35.05,18.69 46.18,18.69 47.3,17.57 49.12,17.57 49.51,17.18 U3.22 ; 22.3,21.81 22.3,24.32 H1.17 ; 22.3,21.81 22.28,21.79 18.01,21.79
P4: length 39.3
  Top Layer w0.254: U3.24 48.51,16.51 48.26,16.75 43.94,16.75 v2(43.64,16.45)
  Bottom Layer w0.254: v2(43.64,16.45) 43.64,17.52 43.38,17.77 17.88,17.77 17.27,18.38 H1.19
P5: length 22.7
  Top Layer w0.254: J2.1 45.14,12.71 45.31,12.54 45.31,11.78 45.82,11.27 v2(46.28,11.27) 46.33,11.27 46.71,10.89 U3.34
  Bottom Layer w0.254: v2(46.28,11.27) 41.76,11.27 41.32,10.83 41.32,3.47 42.01,2.78 44.86,2.78 45.26,2.38 45.26,1.67 H3.8
P9: length 18.9
  Top Layer w0.254: U3.28 46,13.89 v2(45.97,13.86)
  Bottom Layer w0.254: H3.10 40.13,2.83 40.61,3.31 40.61,11.65 41.25,12.28 45.26,12.28 45.62,12.64 45.62,13.5 v2(45.97,13.86)
P10: length 26.5
  Top Layer w0.254: v2(46.23,12.23) 46.23,13 46.62,13.39 U3.29 ; H3.9 44.7,3.65 v2(44.7,4.36)
  Bottom Layer w0.254: J10.1 48.11,5.41 48.11,5.07 47.9,4.87 47.45,4.87 46.94,4.36 v2(44.7,4.36) ; v2(46.23,12.23) 45.87,11.88 41.5,11.88 40.97,11.34 40.97,2.91 42.27,1.62 H3.9
P12: length 66.6
  Top Layer w0.254: 14.73,7.31 C39.2 ; 14.73,7.31 14.73,6.49 14.94,6.29 v2(16.76,6.29) ; 14.73,7.31 10.16,7.31 9.7,6.85 9.7,5.25 SW1.1 ; H1.14 30.07,24.27 30.07,21.89 ; 30.07,21.89 35.66,21.89 35.92,21.63 35.92,20.26 36.17,20.01 50.95,20.01 51.51,19.45 U3.18 ; 30.07,21.89 28.25,21.89 v2(28.09,22.04) ; v2(20.93,6.39) 20.93,8.88 21.28,9.24 21.79,9.24 22.2,9.64 22.2,17.97 v2(22.71,18.48)
  Bottom Layer w0.254: v2(28.09,22.04) 25.96,22.04 25.55,21.63 25.55,19.5 24.54,18.48 v2(22.71,18.48) ; v2(20.93,6.39) 16.87,6.39 v2(16.76,6.29)
P13: length 49.9
  Top Layer w0.254: v2(28.7,19.95) 28.8,20.06 34.17,20.06 34.44,19.78 34.44,17.82 34.95,17.31 37.08,17.31 37.44,16.96 J3.1 ; H1.15 27.48,24.32 27.48,21.73 27.89,21.33 35.15,21.33 35.51,20.97 35.51,19.95 35.92,19.55 47.19,19.55 47.45,19.29 47.45,18.63 47.7,18.38 50.24,18.38 50.51,18.11 U3.20
  Bottom Layer w0.254: v2(28.7,19.95) 28.7,23.1 H1.15
P14: length 47.1
  Top Layer w0.254: U3.17 52.02,16.08 52.02,19.9 51.56,20.36 36.68,20.36 36.42,20.61 36.42,22.34 36.22,22.55 v2(32.46,22.55) 32.46,24.32 H1.13 ; v2(30.53,19.4) 33.73,19.4 34.04,19.09 34.04,17.72 35,16.75 36.32,16.75 36.73,16.35 36.73,10.61 36.93,10.4 37.38,10.4 J4.1
  Bottom Layer w0.254: v2(30.53,19.4) 30.58,19.45 30.58,22.29 30.84,22.55 v2(32.46,22.55)
P15: length 70
  Top Layer w0.254: v2(22.05,19.29) 14.43,19.29 v2(14.38,19.34) ; H1.16 24.89,21.48 25.4,20.97 34.7,20.97 35.15,20.52 35.15,19.4 35.41,19.14 46.74,19.14 47.04,18.84 47.04,18.33 47.35,18.02 49.68,18.02 50.01,17.7 U3.21 ; SW2.1 5.89,6.49 6.45,7.05 8.43,7.05 8.94,7.56 8.94,8.98 9.3,9.34 14.77,9.34 C40.2 14.78,10 v2(14.33,10.45)
  Bottom Layer w0.254: v2(14.38,19.34) 14.38,10.51 v2(14.33,10.45) ; H1.16 24.94,24.32 24.94,19.7 24.54,19.29 v2(22.05,19.29)
P18: length 23.1
  Top Layer w0.254: J5.1 44.68,11.29 44.91,11.06 44.91,10.71 45.21,10.4 46.13,10.4 v2(46.15,10.39) ; v2(46.15,10.39) 45.94,10.39 ; v2(46.15,10.39) U3.35
  Bottom Layer w0.254: 46.23,10.4 45.91,10.4 ; 45.91,10.4 45.93,10.39 v2(46.15,10.39) ; 45.91,10.4 42.32,10.4 41.71,9.8 41.71,3.85 42.42,3.14 47.19,3.14 47.75,2.58 H3.7
P19: length 10.4
  Top Layer w0.254: H3.5 52.83,5.17 52.43,5.58 50.38,5.58 49.01,6.95 U3.38
P21: length 50.4
  Top Layer w0.254: U3.42 51.01,8.06 51.59,7.48 61.26,7.48 61.52,7.23 61.52,3.09 H3.1 63.04,1.67 ; J8.1 36.65,5.25 45.74,5.25 46.48,4.51 46.48,3.19 46.89,2.78 v2(48.56,2.78)
  Bottom Layer w0.254: H3.1 62.94,1.67 62.94,3.85 62.69,4.11 48.82,4.11 48.56,3.85 v2(48.56,2.78)
P22: length 36.2
  Top Layer w0.254: U3.39 49.51,7.12 50.7,5.93 55.17,5.93 55.42,5.68 55.42,1.67 H3.4 ; v2(49.28,3.44) 47.29,3.44 46.99,3.75 46.99,5.12 46.5,5.61 36.57,5.61 36.32,5.86 J7.1
  Bottom Layer w0.254: H3.4 55.37,3.09 55.02,3.44 v2(49.28,3.44)
P23: length 14.1
  Top Layer w0.254: H3.6 50.29,4.82 50.04,5.07 48.97,5.07 47.47,6.57 47.47,8.98 47.83,9.34 U3.36 47.74,9.8 44.06,9.8 J6.1
P25: length 70.3
  Top Layer w0.254: H1.10 v2(40.13,21.73) 40.44,21.43 52.98,21.43 53.51,20.91 U3.14
  Bottom Layer w0.254: J9.1 50.57,6.62 52.12,5.07 59.94,5.07 61.06,6.19 61.06,8.17 60.63,8.6 54.28,8.6 53.75,9.13 53.75,19.29 52.63,20.41 40.59,20.41 40.08,20.92 40.08,21.68 v2(40.13,21.73) ; 40.18,24.32 H1.10
P26: length 23.3
  Top Layer w0.254: H1.11 37.54,24.32 37.54,21.33 37.79,21.07 52.43,21.07 53.01,20.49 U3.15
P27: length 25.1
  Top Layer w0.254: U3.16 52.51,20.28 52.07,20.72 37.19,20.72 36.93,20.97 36.93,22.9 36.68,23.16 35.25,23.16 35.05,23.36 H1.12
P32: length 18.6
  Top Layer w0.254: H1.8 45.26,24.32 45.26,22.39 45.52,22.14 54.1,22.14 55.22,21.02 55.22,15.59 55.02,15.39 U3.12
P33: length 19.2
  Top Layer w0.254: H1.9 42.67,22.04 42.93,21.78 53.44,21.78 54.01,21.22 U3.13
P34: length 15.8
  Top Layer w0.254: H1.6 50.29,23.1 50.55,22.85 54.68,22.85 55.97,21.56 55.97,14.81 55.55,14.39 U3.10
P35: length 17.3
  Top Layer w0.254: H1.7 47.7,24.32 47.7,22.75 47.96,22.5 54.46,22.5 55.57,21.38 55.57,15.23 55.23,14.89 U3.11
P36: length 20.1
  Top Layer w0.254: H1.1 63.04,24.32 63.04,22.09 62.74,21.78 61.16,21.78 60.86,21.48 60.86,12.54 60.21,11.89 U3.5
P37: length 17.4
  Top Layer w0.254: H1.2 60.3,24.22 60.3,12.79 59.9,12.39 U3.6
P38: length 17.8
  Top Layer w0.254: U3.7 59.48,12.89 59.79,13.2 59.79,22.62 59.26,23.16 58.22,23.16 57.96,23.41 57.96,24.32 H1.3
P39: length 18.7
  Top Layer w0.254: U3.8 58.97,13.39 59.28,13.71 59.28,22.24 58.72,22.8 55.98,22.8 55.32,23.46 55.32,24.32 H1.4
RES: length 2.7
  Top Layer w0.254: J3.2 37.79,12.3 U1.6
RS: length 2.7
  Top Layer w0.254: J4.2 37.77,11.59 U1.5
RTS: length 9.7
  Top Layer w0.254: 27.61,16.11 27.54,16.04 26.77,16.04 26.52,15.79 26.52,14.88 26.2,14.56 25.25,14.56 ; v2(27.38,11.72) 27.07,11.42 U2.24 ; 25.25,14.56 R21.2 ; 25.25,14.56 v2(25.25,13.5)
  Bottom Layer w0.254: v2(27.38,11.72) 25.45,11.72 25.2,11.98 25.2,13.45 v2(25.25,13.5)
RX: length 58.2
  Top Layer w0.254: U2.26 26.07,12.4 26.62,12.94 29.92,12.94 30.33,13.35 v2(30.33,14.82) ; U3.40 50.01,7.34 50.8,6.54 v2(57.91,6.54) H3.3
  Bottom Layer w0.254: v2(30.33,14.82) 52.73,14.82 52.98,14.57 52.98,8.34 53.44,7.89 57.38,7.89 57.96,7.31 57.96,6.59 v2(57.91,6.54)
SCL: length 6.4
  Top Layer w0.254: R1.2 35.5,6.83 J7.2 35.52,8.52 34.75,9.28 U5.23
SDA: length 9.8
  Top Layer w0.254: J8.2 R2.2 33.73,5 v2(33.73,5.68) ; U5.24 35.25,10.36 v2(35.61,10)
  Bottom Layer w0.254: v2(33.73,5.68) 33.73,8.3 34.06,8.63 35.36,8.63 35.61,8.88 v2(35.61,10)
TX: length 63.4
  Top Layer w0.254: H3.2 60.4,1.67 v2(60.4,6.54) 60.4,6.87 60.15,7.13 51.03,7.13 50.51,7.65 U3.41 ; U2.25 26.57,11.98 26.97,12.39 30.68,12.39 31.04,12.74 v2(31.04,15.48)
  Bottom Layer w0.254: v2(60.4,6.54) 60.35,6.59 60.35,7.71 59.82,8.24 53.93,8.24 53.39,8.78 53.39,15 53.14,15.26 31.27,15.26 v2(31.04,15.48)
$1N3010: length 8.2
  Top Layer w0.254: U2.9 25.55,5.53 25.55,4.41 25.3,4.16 20.01,4.16 19.65,4.52 R8.2
$1N3024: length 2.9
  Top Layer w0.254: Q5.1 24.65,16.11 23.73,15.18 R21.1
$1N3025: length 2.3
  Top Layer w0.254: 27.31,18.05 27.57,18.05 27.61,18.01 27.61,19.54 R18.1 ; 27.27,18.09 27.27,18.05
$1N3047: length 2.6
  Top Layer w0.254: U5.10 33.73,14.93 33.73,16.6 33.43,16.91 32.95,16.91
$1N3048: length 2.4
  Top Layer w0.254: C21.2 33.67,9.81 33.25,10.23 U5.20
$1N3131: length 6.4
  Top Layer w0.254: 60.54,10.38 65.35,10.38 65.43,10.31 ; 60.54,10.38 C7.2 ; 60.54,10.38 L2.1
$1N4638: length 14.2
  Top Layer w0.254: R24.1 16.41,20.16 14.73,20.16 14.48,20.41 14.48,22.14 14.17,22.44 5.44,22.44 5.06,22.81 POWER.2
$1N4725: length 10.3
  Top Layer w0.254: R28.2 16.47,21.83 15.09,21.83 14.88,22.04 14.88,22.65 14.58,22.95 7.69,22.95 IO2.2
$1N4781: length 10.6
  Top Layer w0.254: USB1.B5 7.56,11.22 5.39,11.22 5.07,11.53 R29.2
$1N4796: length 8.4
  Top Layer w0.254: USB1.A5 7.58,14.27 5.89,14.27 5.59,14.57 5.59,18.23 5.84,18.48 6.96,18.48 7.25,18.77 R30.1

## Copper pours and planes (outline as drawn; the poured copper is in the pictures)
GND on Top Layer: -1.83,27.12 69.04,27.12 69.04,-1.23 -1.83,-1.23
GND on Bottom Layer: -2.39,27.68 70.31,27.68 70.31,-2.45 -2.39,-2.45

Small or netless copper shapes (teardrops, artwork), in the pictures only: 301 on Top Layer, 113 on Bottom Layer

## Text on the board
Bottom Silkscreen Layer: JLCJLCJLCJLC | 5V | CANH | CANL | GND | CAN | Designed by | 4 | 0 | 2 | 3V3 | 15 | 13 | 12 | 14 | 27 | CH | 26 | CL | 9 | 25 | 10 | 33 | 5 | 32 | 35 | 18 | 34 | 23 | 19 | EN | 22 | 39 | 38 | RX | 37 | TX | 21 | 36 | Xia Yuchen | ESP32 PICO CORE
Top Silkscreen Layer: IO15 | IO12 | RST | IMU | TFT
